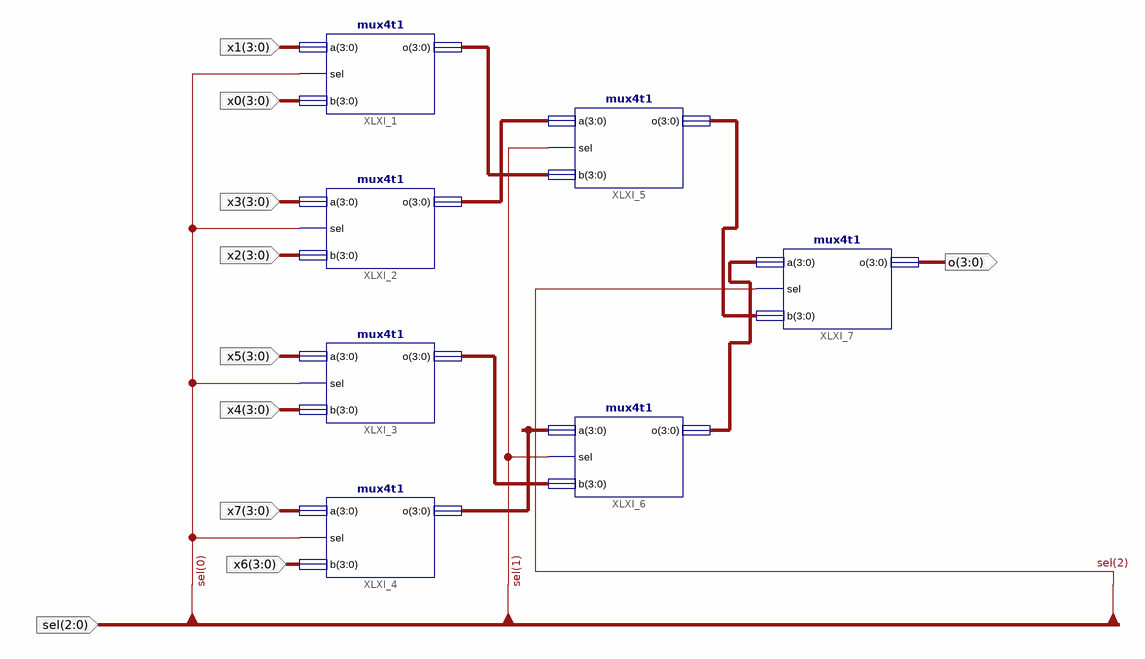
[diagram p0: schematic sheet 1]
// Xilinx ISE schematic mux8t1.sch (kintex7) as structural Verilog: 7 symbols, 10 ports
module mux8t1 (
  input  [3:0] x1,
  input  [3:0] x0,
  input  [3:0] x3,
  input  [3:0] x2,
  input  [3:0] x5,
  input  [3:0] x4,
  input  [3:0] x7,
  input  [3:0] x6,
  input  [2:0] sel,
  output [3:0] o
);

  wire [3:0] XLXN_22, XLXN_24, XLXN_26, XLXN_29, XLXN_33, XLXN_34;

  mux4t1 XLXI_1 (.a(x1), .sel(sel[0]), .b(x0), .o(XLXN_22));
  mux4t1 XLXI_2 (.a(x3), .sel(sel[0]), .b(x2), .o(XLXN_26));
  mux4t1 XLXI_3 (.a(x5), .sel(sel[0]), .b(x4), .o(XLXN_24));
  mux4t1 XLXI_4 (.a(x7), .sel(sel[0]), .b(x6), .o(XLXN_34));
  mux4t1 XLXI_5 (.a(XLXN_26), .sel(sel[1]), .b(XLXN_22), .o(XLXN_29));
  mux4t1 XLXI_6 (.a(XLXN_34), .sel(sel[1]), .b(XLXN_24), .o(XLXN_33));
  mux4t1 XLXI_7 (.a(XLXN_33), .sel(sel[2]), .b(XLXN_29), .o(o));
endmodule
